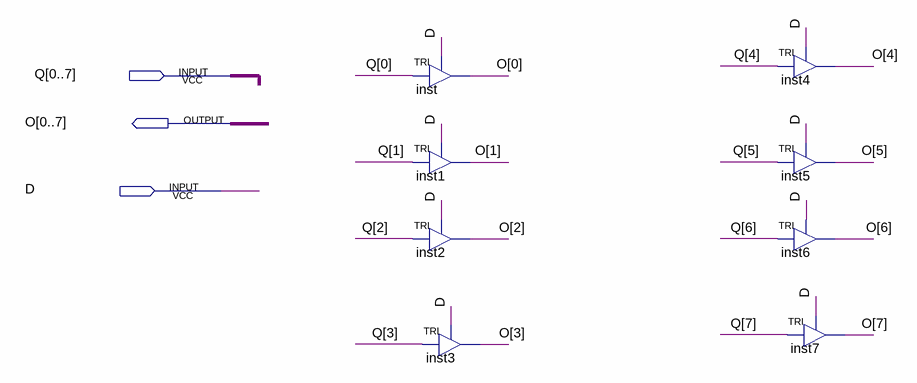
[diagram p0: schematic sheet]
// Quartus schematic TRI8bit.bdf as structural Verilog: 8 symbols, 3 pins
module TRI8bit (
  input  [0:7] Q,
  input  D,
  output [0:7] O
);

  TRI inst (.IN(Q[0]), .OE(D), .OUT(O[0]));
  TRI inst1 (.IN(Q[1]), .OE(D), .OUT(O[1]));
  TRI inst2 (.IN(Q[2]), .OE(D), .OUT(O[2]));
  TRI inst3 (.IN(Q[3]), .OE(D), .OUT(O[3]));
  TRI inst4 (.IN(Q[4]), .OE(D), .OUT(O[4]));
  TRI inst5 (.IN(Q[5]), .OE(D), .OUT(O[5]));
  TRI inst6 (.IN(Q[6]), .OE(D), .OUT(O[6]));
  TRI inst7 (.IN(Q[7]), .OE(D), .OUT(O[7]));
endmodule
